# EAGLE schematic 1stschem (EAGLE 7.2.0)
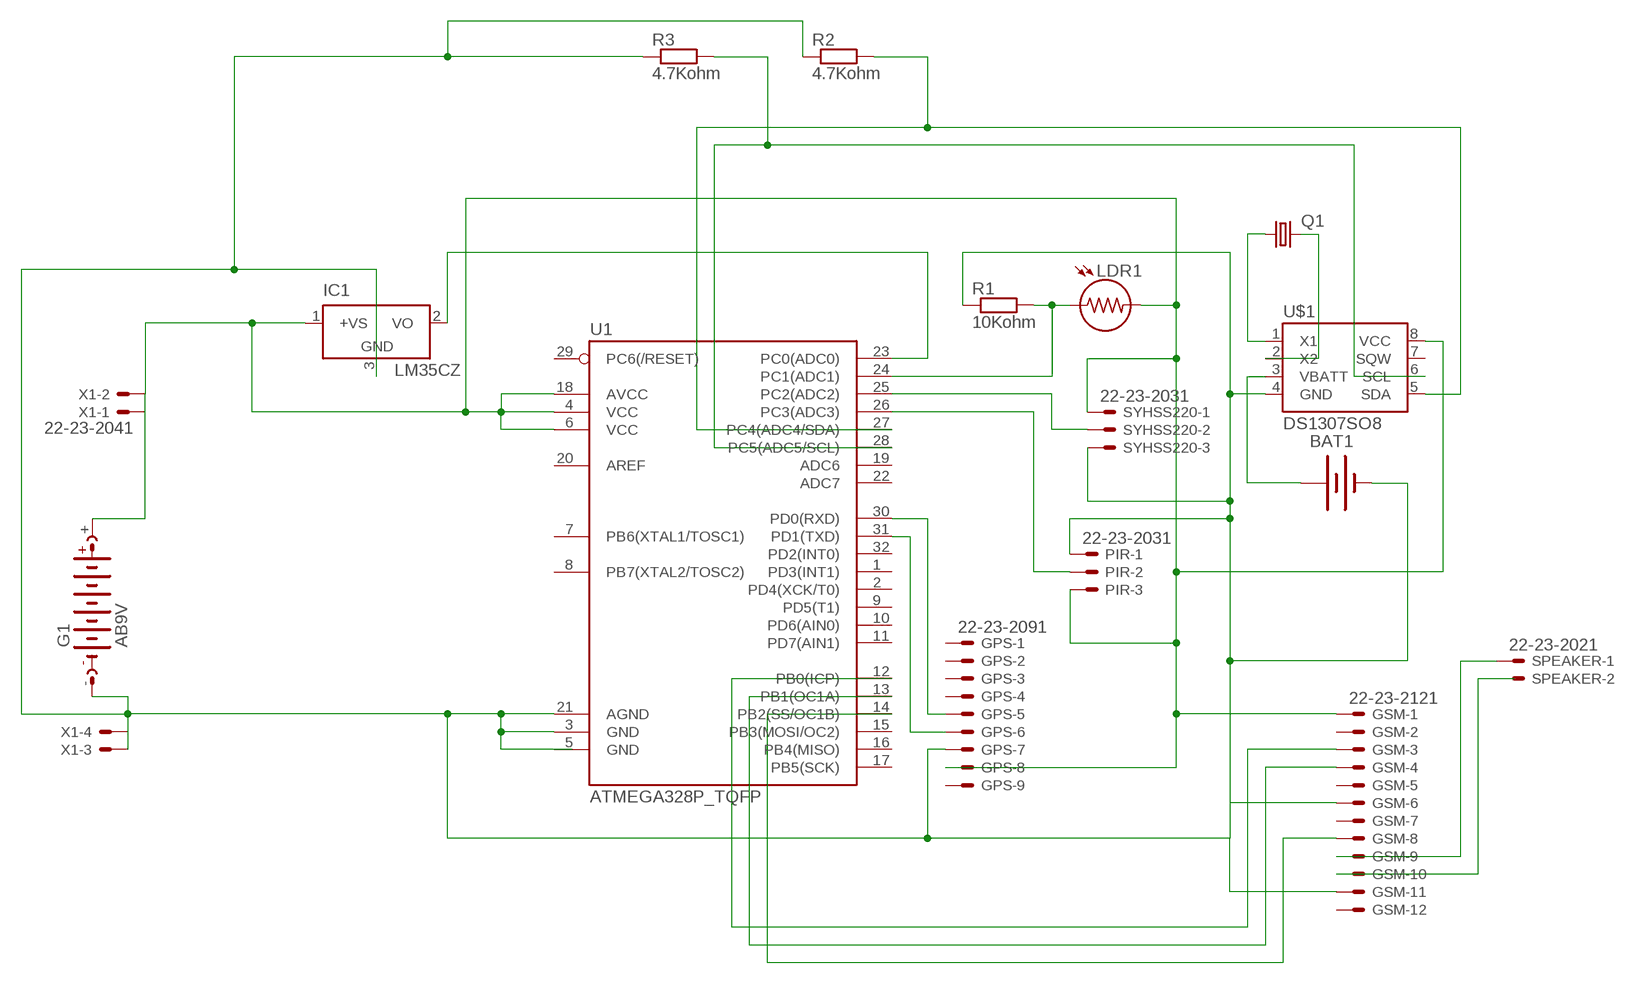
[diagram p0: schematic, sheet 1]

## Parts
BAT1  BATTERY20PTH  [BATTCOM_20MM_PTH]
G1  AB9V  [AB9V]
GPS  22-23-2091  [22-23-2091]
GSM  22-23-2121  [22-23-2121]
IC1  LM35CZ  [TO92]
LDR1  LDR5MM  [LDR338-54C]
PIR  22-23-2031  [22-23-2031]
Q1  CRYSTALTC26H  [TC26H]
R1  10Kohm  6MM-EU4  [R0207/4]
R2  4.7Kohm  6MM-EU4  [R0207/4]
R3  4.7Kohm  6MM-EU4  [R0207/4]
SPEAKER  22-23-2021  [22-23-2021]
SYHSS220  22-23-2031  [22-23-2031]
U1  ATMEGA328P_TQFP  [TQFP32-08]
U$1  DS1307SO8  [SO08]
X1  22-23-2041  [22-23-2041]

## Nets
N$1: G1.+ GPS.8 GSM.1 IC1.1(+VS) LDR1.2 PIR.3 SYHSS220.1 U1.4(VCC) U1.6(VCC) U1.18(AVCC) U$1.8(VCC) X1.1 X1.2
N$2: BAT1.2(-) G1.- GPS.7 GSM.6 GSM.11 IC1.3(GND) PIR.1 R1.1 R2.1 R3.1 SYHSS220.3 U1.3(GND) U1.21(AGND) U$1.4(GND) X1.3 X1.4
N$3: GPS.5 U1.30(PD0(RXD))
N$4: IC1.2(VO) U1.23(PC0(ADC0))
N$5: LDR1.1 R1.2 U1.24(PC1(ADC1))
N$6: GPS.6 U1.31(PD1(TXD))
N$7: SYHSS220.2 U1.25(PC2(ADC2))
N$8: PIR.2 U1.26(PC3(ADC3))
N$9: R2.2 U1.27(PC4(ADC4/SDA)) U$1.5(SDA)
N$10: R3.2 U1.28(PC5(ADC5/SCL)) U$1.6(SCL)
N$11: GSM.3 U1.12(PB0(ICP))
N$12: Q1.1 U$1.1(X1)
N$13: Q1.2 U$1.2(X2)
N$14: GSM.4 U1.13(PB1(OC1A))
N$15: BAT1.1(+) U$1.3(VBATT)
N$16: GSM.8 U1.14(PB2(SS/OC1B))
N$17: GSM.10
N$18: GSM.9 SPEAKER.1
Unconnected: GPS.1 GPS.2 GPS.3 GPS.4 GPS.9 GSM.2 GSM.5 GSM.7 GSM.12 SPEAKER.2 U1.1(PD3(INT1)) U1.2(PD4(XCK/T0)) U1.5(GND) U1.7(PB6(XTAL1/TOSC1)) U1.8(PB7(XTAL2/TOSC2)) U1.9(PD5(T1)) U1.10(PD6(AIN0)) U1.11(PD7(AIN1)) U1.15(PB3(MOSI/OC2)) U1.16(PB4(MISO)) U1.17(PB5(SCK)) U1.19(ADC6) U1.20(AREF) U1.22(ADC7) U1.29(PC6(/RESET)) U1.32(PD2(INT0)) U$1.7(SQW)

## Library data of the parts
BAT1 = SparkFun:BATTERY: Battery Holders Various common sizes : AA, AAA, 20mm coin cell and 12mm coin cell.
G1 = gm-supply:AB9V: 9-V BATTERY CLIP
GPS = con-molex:22-23-2091: .100" (2.54mm) Center Header - 9 Pin; MF: MOLEX; MPN: 22-23-2091; OC_FARNELL: 1756827; OC_NEWARK: 56H0450
GSM = con-molex:22-23-2121: .100" (2.54mm) Center Header - 12 Pin; MF: MOLEX; MPN: 22-23-2121; OC_FARNELL: 1462935; OC_NEWARK: 56H0456
IC1 = lm35:LM35: Single-Supply Centigrade Temperature Sensor Vout = (10mV/°C x Temp °C) +5mmmV Source: http://www.national.com/ds/LM/LM35.pdf
LDR1 = gm-resistors:LDR
PIR SYHSS220 = con-molex:22-23-2031: .100" (2.54mm) Center Header - 3 Pin; MF: MOLEX; MPN: 22-23-2031; OC_FARNELL: 1462950; OC_NEWARK: 30C0862
Q1 = crystal:CRYSTAL: CRYSTAL; OC_FARNELL: unknown; OC_NEWARK: unknown
R1-R3 = gm-resistors:6MM-EU: 6mm Resistors (European schematic symbol) Leads spaced 1-6 holes apart for 0.1" perfboard. Suitable for 1/4 watt resistors.
SPEAKER = con-molex:22-23-2021: .100" (2.54mm) Center Header - 2 Pin; MF: MOLEX; MPN: 22-23-2021; OC_FARNELL: 1462926; OC_NEWARK: 25C3832
U1 = SparkFun-DigitalIC:ATMEGA328P_TQFP; PROD_ID: IC-09069
U$1 = SparkFun:DS1307
X1 = con-molex:22-23-2041: .100" (2.54mm) Center Header - 4 Pin; MF: MOLEX; MPN: 22-23-2041; OC_FARNELL: 1462920; OC_NEWARK: 38C0355